# Altium schematic sheet CAM_Connector.SchDoc
size A3; SheetNumber: 10; SheetTotal: 16
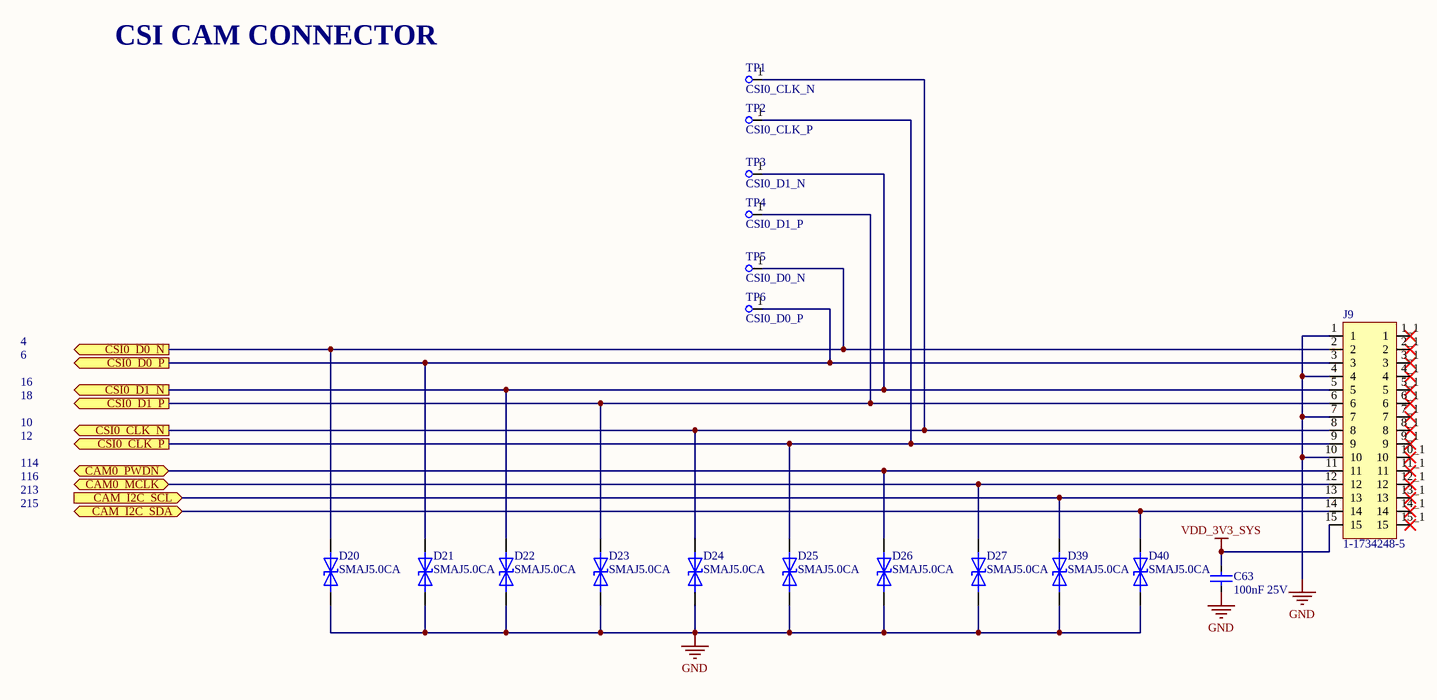
[diagram p0: CAM_Connector.SchDoc]

## Parts
C63  100nF 25V  [C0402]
D20  SMAJ5.0CA  [DO-214AC]
D21  SMAJ5.0CA  [DO-214AC]
D22  SMAJ5.0CA  [DO-214AC]
D23  SMAJ5.0CA  [DO-214AC]
D24  SMAJ5.0CA  [DO-214AC]
D25  SMAJ5.0CA  [DO-214AC]
D26  SMAJ5.0CA  [DO-214AC]
D27  SMAJ5.0CA  [DO-214AC]
D39  SMAJ5.0CA  [DO-214AC]
D40  SMAJ5.0CA  [DO-214AC]
J9  1-1734248-5  [1-1734248-5]
TP1  CSI0_CLK_N  [TestPoint_Pad_D1.0mm]
TP2  CSI0_CLK_P  [TestPoint_Pad_D1.0mm]
TP3  CSI0_D1_N  [TestPoint_Pad_D1.0mm]
TP4  CSI0_D1_P  [TestPoint_Pad_D1.0mm]
TP5  CSI0_D0_N  [TestPoint_Pad_D1.0mm]
TP6  CSI0_D0_P  [TestPoint_Pad_D1.0mm]

## Ports
CAM0_MCLK (bidir), CAM0_PWDN (bidir), CAM_I2C_SCL (in), CAM_I2C_SDA (bidir), CSI0_CLK_N (out), CSI0_CLK_P (out), CSI0_D0_N (out), CSI0_D0_P (out), CSI0_D1_N (out), CSI0_D1_P (out)

## Nets
GND: C63.1 D20.C D21.C D22.C D23.C D24.C D25.C D26.C D27.C D39.C D40.C J9.1 J9.4 J9.7 J9.10
VDD_3V3_SYS: C63.2 J9.15
CAM0_MCLK: D27.A J9.12 ; port CAM0_MCLK
CAM0_PWDN: D26.A J9.11 ; port CAM0_PWDN
CAM_I2C_SCL: D39.A J9.13 ; port CAM_I2C_SCL
CAM_I2C_SDA: D40.A J9.14 ; port CAM_I2C_SDA
CSI0_CLK_N: D24.A J9.8 TP1.1 ; port CSI0_CLK_N
CSI0_CLK_P: D25.A J9.9 TP2.1 ; port CSI0_CLK_P
CSI0_D0_N: D20.A J9.2 TP5.1 ; port CSI0_D0_N
CSI0_D0_P: D21.A J9.3 TP6.1 ; port CSI0_D0_P
CSI0_D1_N: D22.A J9.5 TP3.1 ; port CSI0_D1_N
CSI0_D1_P: D23.A J9.6 TP4.1 ; port CSI0_D1_P

Not connected (* = marked no-connect by the designer): J9 1_1(1)* 2_1(2)* 3_1(3)* 4_1(4)* 5_1(5)* 6_1(6)* 7_1(7)* 8_1(8)* 9_1(9)* 10_1(10)* 11_1(11)* 12_1(12)* 13_1(13)* 14_1(14)* 15_1(15)*

## Notes on the sheet
- CSI CAM CONNECTOR
- 4
- 6
- 10
- 12
- 16
- 18
- 213
- 215
- 114
- 116

## Library data of the parts
C63 = TMK105BJ104KV-F: CAP CER 0.1UF 25V X5R 0402 / High Value Multilayer Ceramic Capacitors (High dielectric type); Manufacturer: Taiyo Yuden; Tolerance: 10%; Supplier 1: Digi-Key; Manufacturer Part Number: TMK105BJ104KV-F; RoHS: Yes; Category: Ceramic Capacitors; Stock 1: 11997960; Pricing 1: 1=0.10000, 10=0.03700, 50=0.02000, 100=0.01630, 500=0.01166, 1000=0.00917, 2500=0.00833, 5000=0.00767 (USD); Mount: Surface Mount; Case/Package: 0402; Number of Pins: 2; Case Code (Imperial): 0402; Case Code (Metric): 1005; Weight: 2.3E-05oz; Min Operating Temperature: -55°C; Max Operating Temperature: 85°C; Capacitance: 100nF; Packaging: Tape and Reel; Dielectric: X5R; Voltage Rating (DC): 25V; Voltage Rating: 25V; Package Quantity: 1; Termination: SMD/SMT; Resistor Type: Ceramic; Voltage: 25V; Series: M; Construction: Flat; Length: 1mm; Width: 0.02inch; Height: 0.5mm; Depth: 0.5mm; Thickness: 0.022inch; Reach SVHC Compliant: Yes; Lead Free: Lead Free; Halogen Free: Halogen Free; RoHS Compliant: Yes; Supplier Part Number 1: 587-1456-1-ND
D20-D27 D39 D40 = SMAJ5.0CA: Transient Voltage Suppressor, TVS, SMAJ Series, Bidirectional, 5 V, DO-214AC, 2, 6.4 V RoHS Compliant: Yes; Manufacturer: Littelfuse; Reverse Breakdown Voltage: 6.4V; Operating Supply Voltage: 5V; Max Surge Current: 43.5A; Number of Elements: 1; Clamping Voltage: 9.2V; Peak Pulse Power: 400W; Power Line Protection: No; Test Current: 10mA; Max Reverse Leakage Current: 800uA; Max Breakdown Voltage: 7V; Max Power Dissipation: 3.3W; Element Configuration: Single; Leakage Current: 1.6mA; Capacitance: 1.05nF; Diode Type: ZENER; Supplier 1: Digi-Key; Manufacturer Part Number: SMAJ5.0CA; RoHS: Yes; Category: TVS Diodes; Stock 1: 526420; Pricing 1: 1=0.43000, 10=0.32000, 100=0.19950, 500=0.13650, 1000=0.10500, 2000=0.09450 (USD); Mount: Surface Mount; Case/Package: DO-214AC; Number of Pins: 2; Min Operating Temperature: -65°C; Max Operating Temperature: 150°C; Package Quantity: 5000; Direction: Bidirectional; Packaging: Tape and Reel; Number of Bidirectional Channels: 1; Reverse Standoff Voltage: 5V; Min Breakdown Voltage: 6.4V; Breakdown Voltage: 6.4V; Number of Channels: 1; Polarity: Bidirectional; Termination: SMD/SMT; Peak Pulse Current: 43.5A; Power Dissipation: 400W; Voltage Rating (DC): 5V; Max Output Current: 43.5A; Resistor Type: Zener; Series: SMAJ; Clamping Voltage-Max: 9.2V; Length: 4.5mm; Width: 2.79mm; Height: 2.087mm; Radiation Hardening: No; Reach SVHC Compliant: Yes; Lead Free: Lead Free; RoHS Compliant: Yes; ComponentLink1URL: https://datasheet.ciiva.com/25624/0900766b810f4edb-25624837.pdf?src-supplier=Rs; ComponentLink1Description: https://datasheet.ciiva.com/25624/0900766b810f4edb-25624837.pdf?src-supplier=Rs; ComponentLink2URL: https://datasheet.ciiva.com/28473/607617-28473438.pdf?src-supplier=Element14; ComponentLink2Description: https://datasheet.ciiva.com/28473/607617-28473438.pdf?src-supplier=Element14; ComponentLink3URL: https://datasheet.ciiva.com/16206/littelfuse-tvs-diode-smaj-16206104.pdf?src-supplier=Future+Electronics; ComponentLink3Description: https://datasheet.ciiva.com/16206/littelfuse-tvs-diode-smaj-16206104.pdf?src-supplier=Future+Electronics; ComponentLink4URL: https://datasheet.ciiva.com/331/littelfuse-tvs-diode-smaj-datasheet-pdf-331055.pdf?src-supplier=Digi-Key; ComponentLink4Description: https://datasheet.ciiva.com/331/littelfuse-tvs-diode-smaj-datasheet-pdf-331055.pdf?src-supplier=Digi-Key; ComponentLink5URL: https://datasheet.ciiva.com/331/littelfuse-tvs-diode-smaj-datasheet-pdf-331056.pdf?src-supplier=Digi-Key; ComponentLink5Description: https://datasheet.ciiva.com/331/littelfuse-tvs-diode-smaj-datasheet-pdf-331056.pdf?src-supplier=Digi-Key; ComponentLink6URL: https://datasheet.ciiva.com/331/littelfuse-tvs-diode-smaj-datasheet-pdf-331054.pdf?src-supplier=Digi-Key; ComponentLink6Description: https://datasheet.ciiva.com/331/littelfuse-tvs-diode-smaj-datasheet-pdf-331054.pdf?src-supplier=Digi-Key; Supplier Part Number 1: SMAJ5.0CALFCT-ND
J9 = 1-1734248-5: FPC CONNECTOR, RECEPTACLE 15POS 1MMPITCH; Series: FPC; Gender: Receptacle; Pitch S; Manufacturer: TE Connectivity; Actuator Material: Nylon,Polyamide; Actuator Color: Black; Current Rating: 1A; Voltage Rating: 125V; Number of Positions: 15; Shielding: Unshielded; Connector Type: Receptacle,Connector,Socket; Wire/Cable Type: Flat Flex; Connector System: Flex-to-Board; Mating Alignment: Yes (With); PCB Mount Alignment: No (Without); PCB Mount Retention: With; Circuit Application: Signal; Pitch: 1mm; Supplier 1: Digi-Key; Manufacturer Part Number: 1-1734248-5; RoHS: Yes; Category: FFC / FPC; Stock 1: 68466; Pricing 1: 1=1.28000, 10=1.08100, 25=1.03680, 50=1.01460, 100=0.97050, 250=0.88224, 500=0.79402 (USD); Mount: Surface Mount; Contact Plating: Gold; Contact Material: Bronze; Housing Color: Black; Housing Material: Polyamide; Min Operating Temperature: -4°C; Max Operating Temperature: 185°C; Package Quantity: 1000; Packaging: Tape and Reel; Number of Rows: 1; Termination: SMD/SMT; Number of Contacts: 15; Orientation: Straight; Sealable: No (Without); Shrouded: Yes (With); Contact Current Rating: 1A; Length: 22.4mm; Width: 4.6mm; Height: 7.7mm; Depth: 4.6mm; ELV: Compliant; Flammability Rating: UL94 V-0; RoHS Compliant: Yes; ComponentLink3URL: https://datasheet.ciiva.com/672/eng-cd-1734248-e1-672178.pdf?src-supplier=Digi-Key; ComponentLink3Description: Datasheet; Supplier Part Number 1: A101418DKR-ND
TP1-TP6 = TestPoint_D1mm